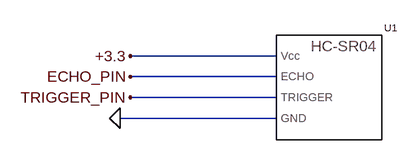
[diagram p0: schematic ultrasonic.asc]
ultrasonic.asc, the LTspice schematic file:
Version 4.1
SHEET 1 880 680
WIRE 160 64 -64 64
WIRE 160 96 -64 96
WIRE 160 128 -64 128
WIRE 160 160 -80 160
FLAG -64 64 +3.3
FLAG -64 96 ECHO_PIN
FLAG -64 128 TRIGGER_PIN
FLAG -80 160 0
SYMBOL ultrasonic_sensor 160 32 R0
SYMATTR InstName U1

The netlist it stands for:
* ultrasonic.asc
X§U1 +3.3 ECHO_PIN TRIGGER_PIN 0 ultrasonic_sensor  ; pins Vcc ECHO TRIGGER GND
.backanno
.end